# EAGLE schematic dual.vca.main (EAGLE 9.5.1)
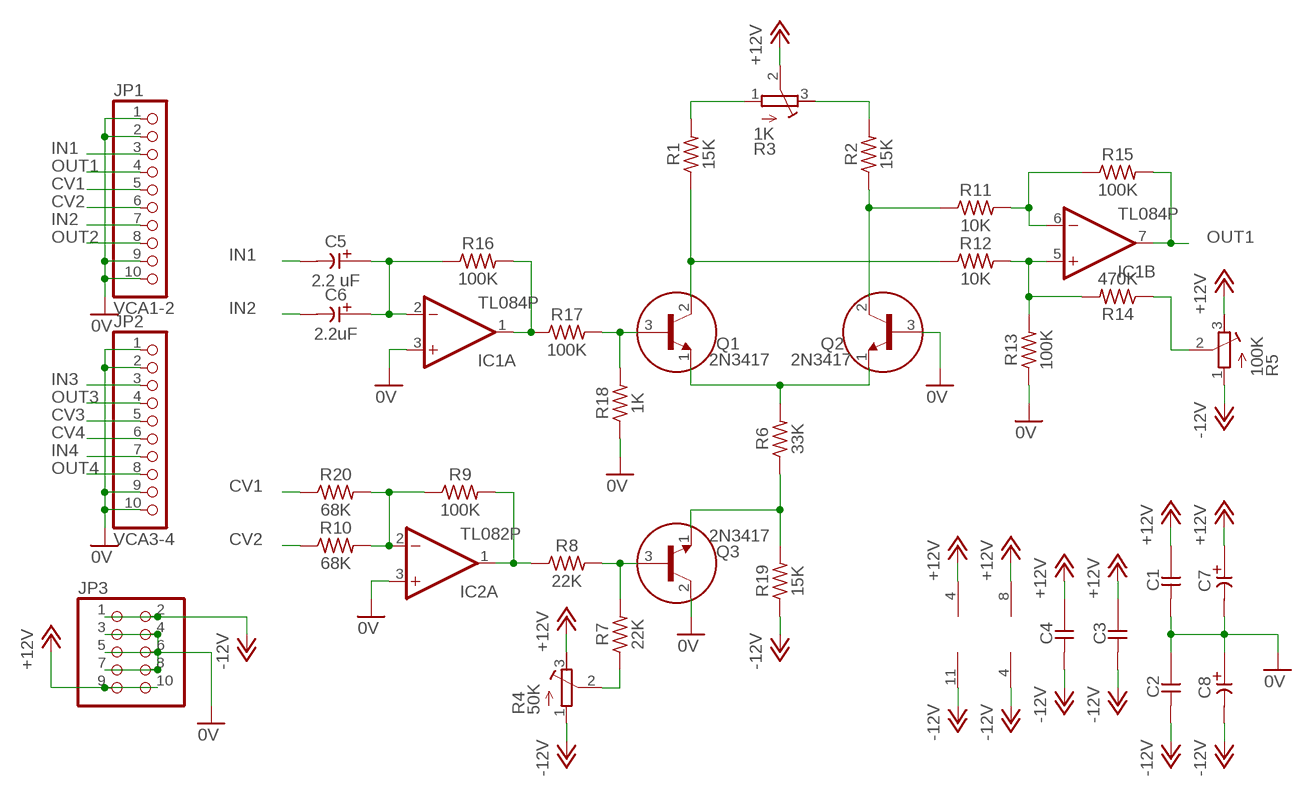
[diagram p0: schematic, sheet 1]

## Parts
C1  CC-US025-024X044  [C025-024X044]
C2  CC-US025-024X044  [C025-024X044]
C3  CC-US025-024X044  [C025-024X044]
C4  CC-US025-024X044  [C025-024X044]
C5  2.2 uF  CE-USE2-5  [E2-5]
C6  2.2uF  CE-USE2-5  [E2-5]
C7  CE-USE2-5  [E2-5]
C8  CE-USE2-5  [E2-5]
IC1  TL084P  [DIL14]
IC2  TL082P  [DIL08]
JP1  VCA1-2  PINHD-1X10  [1X10]
JP2  VCA3-4  PINHD-1X10  [1X10]
JP3  PINHD-2X5  [2X05]
Q1  2N3417  [TO92]
Q2  2N3417  [TO92]
Q3  2N3417  [TO92]
R1  15K  R  [0207/7]
R2  15K  R  [0207/7]
R3  1K  R-TRIMM3339P  [RTRIM3339P]
R4  50K  R-TRIMM3339P  [RTRIM3339P]
R5  100K  R-TRIMM3339P  [RTRIM3339P]
R6  33K  R  [0207/7]
R7  22K  R  [0207/7]
R8  22K  R  [0207/7]
R9  100K  R  [0207/7]
R10  68K  R  [0207/7]
R11  10K  R  [0207/7]
R12  10K  R  [0207/7]
R13  100K  R  [0207/7]
R14  470K  R  [0207/7]
R15  100K  R  [0207/7]
R16  100K  R  [0207/7]
R17  100K  R  [0207/7]
R18  1K  R  [0207/7]
R19  15K  R  [0207/7]
R20  68K  R  [0207/7]

## Nets
0V: C1.2 C2.1 C7.- C8.+ IC1.3(A:+IN) IC2.3(A:+IN) JP1.1 JP1.2 JP1.9 JP1.10 JP2.1 JP2.2 JP2.9 JP2.10 JP3.3 JP3.4 JP3.5 JP3.6 JP3.7 JP3.8 Q2.3(B) Q3.2(C) R13.1 R18.1
+12V: C1.1 C3.1 C4.1 C7.+ IC1.4(P:V+) IC2.8(P:V+) JP3.9 JP3.10 R3.2(S) R4.3(E) R5.3(E)
-12V: C2.2 C3.2 C4.2 C8.- IC1.11(P:V-) IC2.4(P:V-) JP3.1 JP3.2 R4.1(A) R5.1(A) R19.1
CV1: JP1.5 R20.1
CV2: JP1.6 R10.1
CV3: JP2.5
CV4: JP2.6
IN1: C5.- JP1.3
IN2: C6.- JP1.7
IN3: JP2.3
IN4: JP2.7
N$1: C5.+ C6.+ IC1.2(A:-IN) R16.1
N$2: IC1.6(B:-IN) R11.2 R15.1
N$3: IC1.1(A:OUT) R16.2 R17.1
N$4: Q1.3(B) R17.2 R18.2
N$5: Q1.2(C) R1.1 R12.1
N$6: R1.2 R3.1(A)
N$7: R2.2 R3.3(E)
N$8: Q2.2(C) R2.1 R11.1
N$9: Q1.1(E) Q2.1(E) R6.2
N$10: R5.2(S) R14.1
N$12: IC1.5(B:+IN) R12.2 R13.2 R14.2
N$13: Q3.1(E) R6.1 R19.2
N$15: Q3.3(B) R7.2 R8.2
N$16: R4.2(S) R7.1
N$17: IC2.1(A:OUT) R8.1 R9.2
N$18: IC2.2(A:-IN) R9.1 R10.2 R20.2
OUT1: IC1.7(B:OUT) JP1.4 R15.2
OUT2: JP1.8
OUT3: JP2.4
OUT4: JP2.8
Unconnected: IC1.8(C:OUT) IC1.9(C:-IN) IC1.10(C:+IN) IC1.12(D:+IN) IC1.13(D:-IN) IC1.14(D:OUT) IC2.5(B:+IN) IC2.6(B:-IN) IC2.7(B:OUT)

## Library data of the parts
C1-C4 = _common:CC-US: CAPACITOR, US symbol
C5-C8 = _common:CE-US: ELECTROLYTIC CAPACITOR, US symbol
IC1 = linear:TL084: OP AMP
IC2 = linear:TL082: OP AMP Data sheet <http://www.ti.com/lit/ds/symlink/tl084a . pdf>; DATA_SHEET: <a href="http://www.ti.com/lit/ds/symlink/tl084a.pdf"> Data sheet </a>
JP1 JP2 = pinhead:PINHD-1X10: PIN HEADER
JP3 = pinhead:PINHD-2X5: PIN HEADER
Q1-Q3 = _common:2N3417: NPN Transistor
R1 R2 R6-R20 = _common:R: RESISTOR, US symbol
R3-R5 = rcl:R-TRIMM: Trimm resistor; SPICEMODEL: X; SPICEPREFIXL: POT